# Altium schematic sheet Headers-SolderPads.SchDoc: Headers / Solder pads
size A4; Author: Lázár Sándor; SheetNumber: 5; SheetTotal: 6; URL: lzrsystems.com
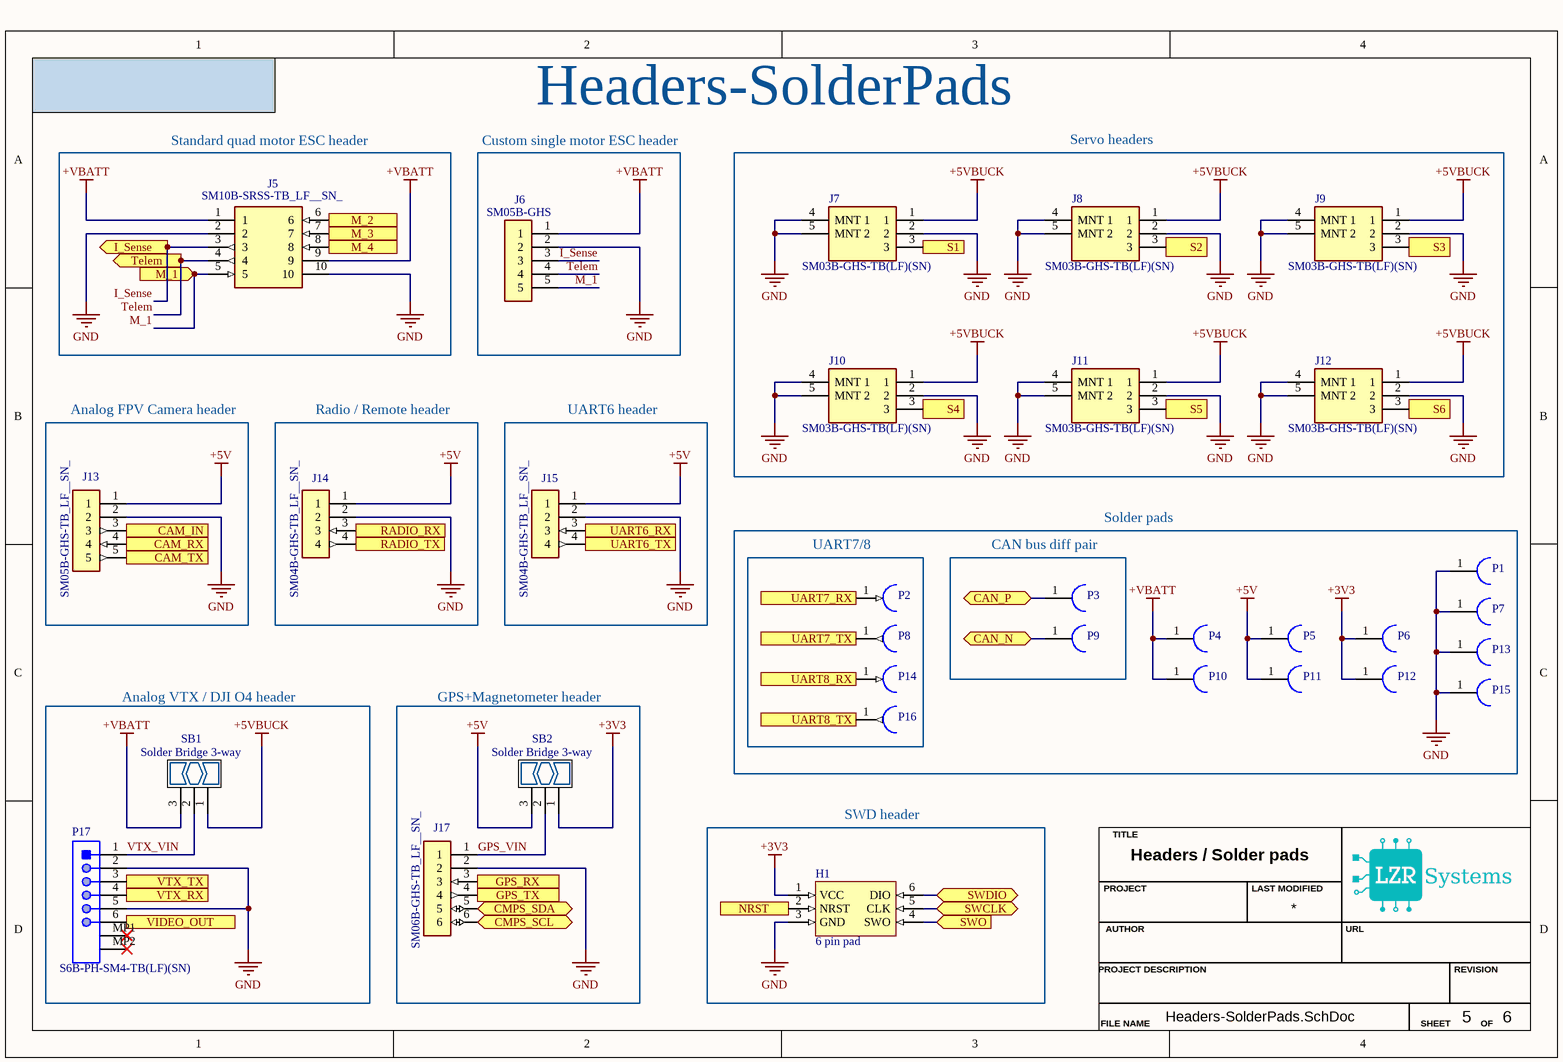
[diagram p0: Headers-SolderPads.SchDoc]

## Parts
H1  6 pin pad  [6 pin pad-Footprint-1]
J5  SM10B-SRSS-TB_LF__SN_  [SM10B-SRSS-TB]
J6  SM05B-GHS  [SM05B-GHS-TB]
J7  SM03B-GHS-TB(LF)(SN)  [FP-SM03B-GHS-TB_LF_SN-MFG]
J8  SM03B-GHS-TB(LF)(SN)  [FP-SM03B-GHS-TB_LF_SN-MFG]
J9  SM03B-GHS-TB(LF)(SN)  [FP-SM03B-GHS-TB_LF_SN-MFG]
J10  SM03B-GHS-TB(LF)(SN)  [FP-SM03B-GHS-TB_LF_SN-MFG]
J11  SM03B-GHS-TB(LF)(SN)  [FP-SM03B-GHS-TB_LF_SN-MFG]
J12  SM03B-GHS-TB(LF)(SN)  [FP-SM03B-GHS-TB_LF_SN-MFG]
J13  SM05B-GHS-TB_LF__SN_  [SM05B-GHS-TB]
J14  SM04B-GHS-TB_LF__SN_  [SM04B-GHS-TB]
J15  SM04B-GHS-TB_LF__SN_  [SM04B-GHS-TB]
J17  SM06B-GHS-TB_LF__SN_  [SM06B-GHS-TB]
P1  Solder Pad 2x1.5mm  [Solder Pad 2x1.5mm-Footprint-1]  (value not drawn)
P2  Solder Pad 2x1.5mm  [Solder Pad 2x1.5mm-Footprint-1]  (value not drawn)
P3  Solder Pad 2x1.5mm  [Solder Pad 2x1.5mm-Footprint-1]  (value not drawn)
P4  Solder Pad 2x1.5mm  [Solder Pad 2x1.5mm-Footprint-1]  (value not drawn)
P5  Solder Pad 2x1.5mm  [Solder Pad 2x1.5mm-Footprint-1]  (value not drawn)
P6  Solder Pad 2x1.5mm  [Solder Pad 2x1.5mm-Footprint-1]  (value not drawn)
P7  Solder Pad 2x1.5mm  [Solder Pad 2x1.5mm-Footprint-1]  (value not drawn)
P8  Solder Pad 2x1.5mm  [Solder Pad 2x1.5mm-Footprint-1]  (value not drawn)
P9  Solder Pad 2x1.5mm  [Solder Pad 2x1.5mm-Footprint-1]  (value not drawn)
P10  Solder Pad 2x1.5mm  [Solder Pad 2x1.5mm-Footprint-1]  (value not drawn)
P11  Solder Pad 2x1.5mm  [Solder Pad 2x1.5mm-Footprint-1]  (value not drawn)
P12  Solder Pad 2x1.5mm  [Solder Pad 2x1.5mm-Footprint-1]  (value not drawn)
P13  Solder Pad 2x1.5mm  [Solder Pad 2x1.5mm-Footprint-1]  (value not drawn)
P14  Solder Pad 2x1.5mm  [Solder Pad 2x1.5mm-Footprint-1]  (value not drawn)
P15  Solder Pad 2x1.5mm  [Solder Pad 2x1.5mm-Footprint-1]  (value not drawn)
P16  Solder Pad 2x1.5mm  [Solder Pad 2x1.5mm-Footprint-1]  (value not drawn)
P17  S6B-PH-SM4-TB(LF)(SN)  [JST-S6B-PH-SM4-TB(LF)(SN)_V]
SB1  Solder Bridge 3-way  [Solder Bridge 3-way-Footprint-1]
SB2  Solder Bridge 3-way  [Solder Bridge 3-way-Footprint-1]

## Blocks framed on the sheet
Standard quad motor ESC header: J5
Custom single motor ESC header: J6
Servo headers: J7-J12
Analog FPV Camera header: J13
Radio / Remote header: J14
UART6 header: J15
Solder pads: P1 P4-P7 P10-P13 P15
UART7/8: P2 P8 P14 P16
CAN bus diff pair: P3 P9
Analog VTX / DJI O4 header: P17 SB1
GPS+Magnetometer header: J17 SB2
SWD header: H1

## Ports
CAM_IN (out), CAM_RX (in), CAM_TX (out), CAN_N (bidir), CAN_P (bidir), CMPS_SCL (bidir), CMPS_SDA (bidir), GPS_RX (in), GPS_TX (out), I_Sense (out), M_1 (in), M_2 (in), M_3 (in), M_4 (in), NRST (out), RADIO_RX (in), RADIO_TX (out), S1 (in), S2 (in), S3 (in), S4 (in), S5 (in), S6 (in), SWCLK (bidir), SWDIO (bidir), SWO (in), Telem (out), UART6_RX (in), UART6_TX (out), UART7_RX (in), UART7_TX (out), UART8_RX (in), UART8_TX (out), VIDEO_OUT (in), VTX_RX (in), VTX_TX (out)

## Nets
+3V3: H1.1(VCC) P6.1 P12.1 SB2.1
+5V: J13.1 J14.1 J15.1 P5.1 P11.1 SB2.3
+5VBUCK: J7.1 J8.1 J9.1 J10.1 J11.1 J12.1 SB1.1
+VBATT: J5.1 J5.9 J6.1 P4.1 P10.1 SB1.3
GND: H1.3(GND) J5.2 J5.10 J6.2 J7.2 J7.4(MNT_1) J7.5(MNT_2) J8.2 J8.4(MNT_1) J8.5(MNT_2) J9.2 J9.4(MNT_1) J9.5(MNT_2) J10.2 J10.4(MNT_1) J10.5(MNT_2) J11.2 J11.4(MNT_1) J11.5(MNT_2) J12.2 J12.4(MNT_1) J12.5(MNT_2) J13.2 J14.2 J15.2 J17.2 P1.1 P7.1 P13.1 P15.1 P17.2 P17.5
CAM_IN: J13.3 ; port CAM_IN
CAM_RX: J13.4 ; port CAM_RX
CAM_TX: J13.5 ; port CAM_TX
CAN_N: P9.1 ; port CAN_N
CAN_P: P3.1 ; port CAN_P
CMPS_SCL: J17.6 ; port CMPS_SCL
CMPS_SDA: J17.5 ; port CMPS_SDA
GPS_RX: J17.3 ; port GPS_RX
GPS_TX: J17.4 ; port GPS_TX
GPS_VIN: J17.1 SB2.2
I_Sense: J5.3 J6.3 ; port I_Sense
M_1: J5.5 J6.5 ; port M_1
M_2: J5.6 ; port M_2
M_3: J5.7 ; port M_3
M_4: J5.8 ; port M_4
NRST: H1.2(NRST) ; port NRST
RADIO_RX: J14.3 ; port RADIO_RX
RADIO_TX: J14.4 ; port RADIO_TX
S1: J7.3 ; port S1
S2: J8.3 ; port S2
S3: J9.3 ; port S3
S4: J10.3 ; port S4
S5: J11.3 ; port S5
S6: J12.3 ; port S6
SWCLK: H1.5(CLK) ; port SWCLK
SWDIO: H1.6(DIO) ; port SWDIO
SWO: H1.4(SWO) ; port SWO
Telem: J5.4 J6.4 ; port Telem
UART6_RX: J15.3 ; port UART6_RX
UART6_TX: J15.4 ; port UART6_TX
UART7_RX: P2.1 ; port UART7_RX
UART7_TX: P8.1 ; port UART7_TX
UART8_RX: P14.1 ; port UART8_RX
UART8_TX: P16.1 ; port UART8_TX
VIDEO_OUT: P17.6 ; port VIDEO_OUT
VTX_RX: P17.4 ; port VTX_RX
VTX_TX: P17.3 ; port VTX_TX
VTX_VIN: P17.1 SB1.2

Not connected (* = marked no-connect by the designer): P17 MP1* MP2*

## Notes on the sheet
- Headers-SolderPads
- TITLE
- AUTHOR
- PROJECT
- LAST MODIFIED
- URL
- PROJECT DESCRIPTION
- REVISION
- FILE NAME
- SHEET
- OF

## Library data of the parts
H1 = CMP-002-00084-1
J5 = SM10B-SRSS-TB_LF__SN_: Connector; Manufacturer_Name: JST (JAPAN SOLDERLESS TERMINALS); Manufacturer_Part_Number: SM10B-SRSS-TB(LF)(SN); Datasheet Link: http://www.jst-mfg.com/product/pdf/eng/eSR.pdf; Mouser Part Number: 306-SM10BSRSSTBLFSN; Mouser Price/Stock: https://www.mouser.co.uk/ProductDetail/JST-Commercial/SM10B-SRSS-TBLFSN?qs=QpmGXVUTftHkZAI%2F8hE40w%3D%3D; Arrow Part Number: SM10B-SRSS-TB(LF)(SN); Arrow Price/Stock: https://www.arrow.com/en/products/sm10b-srss-tb-lf-sn/jst-manufacturing?utm_currency=USD&region=europe
J6 J13 = SM05B-GHS-TB_LF__SN_: Connector; Manufacturer_Name: JST (JAPAN SOLDERLESS TERMINALS); Manufacturer_Part_Number: SM05B-GHS-TB(LF)(SN); Datasheet Link: https://datasheet.datasheetarchive.com/originals/distributors/Datasheets_SAMA/e4ef010dc292ea31091454f6c0afb63a.pdf; Mouser Part Number: N/A; Mouser Price/Stock: https://www.mouser.co.uk/ProductDetail/JST-Commercial/SM05B-GHS-TBLFSN?qs=QpmGXVUTftEjojOT4U3d6Q%3D%3D; Arrow Part Number: SM05B-GHS-TB(LF)(SN); Arrow Price/Stock: https://www.arrow.com/en/products/sm05b-ghs-tb-lf-sn/jst-manufacturing?utm_currency=USD&region=europe
J7-J12 = CMP-002-00093-1: MCU 32-bit LPC1800 ARM Cortex M3 RISC 1024KB Flash 3.3V 100-Pin TFBGA Tray; Gender: Male; Voltage Rating: 50V; Connector Type: Male Pin, Outer Shroud Contact; Min Operating Temperature: -25°C; Mounting Technology: Surface Mount; Pins: 3; Max Operating Temperature: 85°C
J14 J15 = SM04B-GHS-TB_LF__SN_: Connector; Manufacturer_Name: JST (JAPAN SOLDERLESS TERMINALS); Manufacturer_Part_Number: SM04B-GHS-TB(LF)(SN); Datasheet Link: http://uk.rs-online.com/web/p/products/7521797; Mouser Part Number: N/A; Mouser Price/Stock: https://www.mouser.co.uk/ProductDetail/JST-Commercial/SM04B-GHS-TBLFSN?qs=QpmGXVUTftEJzKB1YHGCXw%3D%3D; Arrow Part Number: SM04B-GHS-TB(LF)(SN); Arrow Price/Stock: https://www.arrow.com/en/products/sm04b-ghs-tb-lf-sn-/jst-manufacturing?region=europe
J17 = SM06B-GHS-TB_LF__SN_: Connector; Manufacturer_Name: JST (JAPAN SOLDERLESS TERMINALS); Manufacturer_Part_Number: SM06B-GHS-TB(LF)(SN); Datasheet Link: https://datasheet.datasheetarchive.com/originals/distributors/Datasheets_SAMA/e4ef010dc292ea31091454f6c0afb63a.pdf; Mouser Part Number: N/A; Mouser Price/Stock: https://www.mouser.co.uk/ProductDetail/JST-Commercial/SM06B-GHS-TBLFSN?qs=QpmGXVUTftFzTQe43vH9Ig%3D%3D; Arrow Part Number: SM06B-GHS-TB(LF)(SN); Arrow Price/Stock: https://www.arrow.com/en/products/sm06b-ghs-tb-lf-sn/jst-manufacturing
P1-P16 = CMP-00001-1: Solder Pad 2x1.5mm, 0.5mm hole
P17 = CMP-002-00086-2: Connector Header, PH Series, 6 Position, Side Entry, 2.00mm, Solder, Surface Mount, Natural.; Gender: Male; Connector Type: Male Pin; Voltage Rating: 100V; Max Current Rating: 2A; Pins: 6; Max Operating Temperature: 85°C; Mounting Technology: Surface Mount; Min Operating Temperature: -25°C
SB1 SB2 = CMP-00030-00002-4: 3-way solder bridge mainly for power rail selection